# Altium schematic sheet power.SchDoc
size A3; SheetNumber: 2; SheetTotal: 3
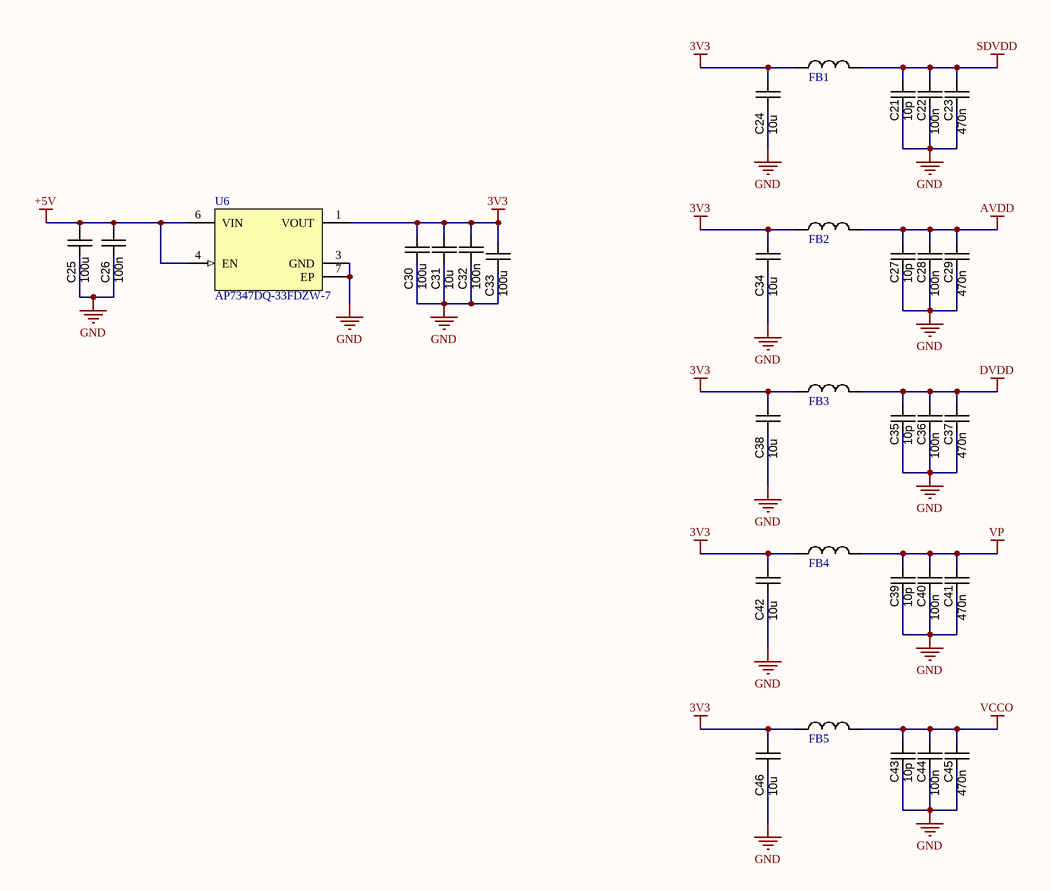
[diagram p0: power.SchDoc]

## Parts
C21  10p  [CAPC1005N]
C22  100n  [CAPC1005N]
C23  470n  [CAPC1005N]
C24  value 10u  [CAPC1608N]  (hidden comment: approved sub OK)
C25  value 100u  [CAPC2012N]  (hidden comment: approved sub OK)
C26  100n  [CAPC1005N]
C27  10p  [CAPC1005N]
C28  100n  [CAPC1005N]
C29  470n  [CAPC1005N]
C30  value 100u  [CAPC2012N]  (hidden comment: approved sub OK)
C31  value 10u  [CAPC1608N]  (hidden comment: approved sub OK)
C32  100n  [CAPC1005N]
C33  value 100u  [CAPC2012N]  (hidden comment: approved sub OK)
C34  value 10u  [CAPC1608N]  (hidden comment: approved sub OK)
C35  10p  [CAPC1005N]
C36  100n  [CAPC1005N]
C37  470n  [CAPC1005N]
C38  value 10u  [CAPC1608N]  (hidden comment: approved sub OK)
C39  10p  [CAPC1005N]
C40  100n  [CAPC1005N]
C41  470n  [CAPC1005N]
C42  value 10u  [CAPC1608N]  (hidden comment: approved sub OK)
C43  10p  [CAPC1005N]
C44  100n  [CAPC1005N]
C45  470n  [CAPC1005N]
C46  value 10u  [CAPC1608N]  (hidden comment: approved sub OK)
FB1  Ferrite  [INDC1608N]  (value not drawn)
FB2  Ferrite  [INDC1608N]  (value not drawn)
FB3  Ferrite  [INDC1608N]  (value not drawn)
FB4  Ferrite  [INDC1608N]  (value not drawn)
FB5  Ferrite  [INDC1608N]  (value not drawn)
U6  AP7347DQ-33FDZW-7  [WDFN2020-6]

## Nets
3V3: C24.1 C30.1 C31.1 C32.2 C33.1 C34.1 C38.1 C42.1 C46.1 FB1.1 FB2.1 FB3.1 FB4.1 FB5.1 U6.1(VOUT)
+5V: C25.1 C26.2 U6.4(EN) U6.6(VIN)
AVDD: C27.1 C28.1 C29.1 FB2.2
DVDD: C35.1 C36.1 C37.1 FB3.2
GND: C21.2 C22.2 C23.2 C24.2 C25.2 C26.1 C27.2 C28.2 C29.2 C30.2 C31.2 C32.1 C33.2 C34.2 C35.2 C36.2 C37.2 C38.2 C39.2 C40.2 C41.2 C42.2 C43.2 C44.2 C45.2 C46.2 U6.3(GND) U6.7(EP)
SDVDD: C21.1 C22.1 C23.1 FB1.2
VCCO: C43.1 C44.1 C45.1 FB5.2
VP: C39.1 C40.1 C41.1 FB4.2

## Library data of the parts
C21-C23 C26-C29 C32 C35-C37 C39-C41 C43-C45 = CAPC_10n_0402_16V_10%: Capacitor SMD Cer 10nF 10% 16V X7R 0402; Manufacturer 1: AVX Corporation; Manufacturer Part Number 1: 0402YC103KAT2A; Ratings: 16V; X7R; Tolerance: ±10%; Operating Temperature: -55°C ~ 125°C; Package / Case: 0402 (1005 Metric); Size / Dimension: 0.039" L x 0.020" W (1.00mm x 0.50mm); Manufacturer 2: Yageo; Manufacturer Part Number 2: CC0402KRX7R7BB103; Supplier 1: Digi-Key; Supplier Part Number 1: 478-1114-1-ND; ComponentLink1URL: http://www.avx.com/docs/Catalogs/cx7r.pdf; ComponentLink1Description: http://www.avx.com/docs/Catalogs/cx7r.pdf; Supplier 2: Digi-Key; Supplier Part Number 2: 311-1042-1-ND; ComponentLink2URL: http://www.yageo.com/documents/recent/UPY-GPHC_X7R_6.3V-to-50V_8.pdf; ComponentLink2Description: http://www.yageo.com/documents/recent/UPY-GPHC_X7R_6.3V-to-50V_8.pdf
  C21 C27 C35 C39 C43: Value: 10p
  C22 C26 C28 C32 C36 C40 C44: Value: 100n
  C23 C29 C37 C41 C45: Value: 470n
C24 C31 C34 C38 C42 C46 = CAPC_560p_0603_5%: Capacitor SMD Cer 560pF 5% 50V NP0 0603; Manufacturer 1: AVX Corporation; Manufacturer Part Number 1: 06035A561JAT2A; Ratings: 50V; NP0; Material: ceramic; Capacitance: 470pF; Package / Case: 0603 (1608 metric); Voltage - Rated: 50V; Mounting Type: Surface Mount, MLCC; Operating Temperature: -55°C ~ 125°C; Applications: General Purpose; Size / Dimension: 0.063" L x 0.032" W (1.60mm x 0.81mm); Height - Seated (Max): -; Thickness (Max): 0.035" (0.90mm); Lead Spacing: -; Lead Style: -; ComponentLink1URL: http://www.avx.com/docs/Catalogs/ccog.pdf; ComponentLink1Description: http://www.avx.com/docs/Catalogs/ccog.pdf; Supplier 1: Digi-Key; Supplier Part Number 1: 478-1184-1-ND
C25 C30 C33 = CAPC_1u_0805: Capacitor SMD Cer 1uF 10% 16V X7R 0805; Manufacturer 1: TDK Corporation; Manufacturer Part Number 1: C2012X7R1C105K/1.25; Ratings: 16V; X7R; Material: ceramic; Package / Case: 0805 (2012 metric); Tolerance: ±10%; Supplier 1: Digi-Key; Supplier Part Number 1: 445-1358-1-ND
U6 = AP7347DQ-33FDZW-7: Linear Voltage Regulator IC Positive 500mA Very High PSRR; MF: Diodes Inc.; MP: AP7361C-FGE-7; SnapEDA_Link: https://www.snapeda.com/parts/AP7361C-FGE-7/Diodes+Inc./view-part/?ref=snap; Package: UDFN-8 Diodes Inc.; Value: *; Check_prices: https://www.snapeda.com/parts/AP7361C-FGE-7/Diodes+Inc./view-part/?ref=eda